# Altium schematic sheet iWoofer_V4_03_OT.SchDoc
size A4; DrawnBy: iWoofer
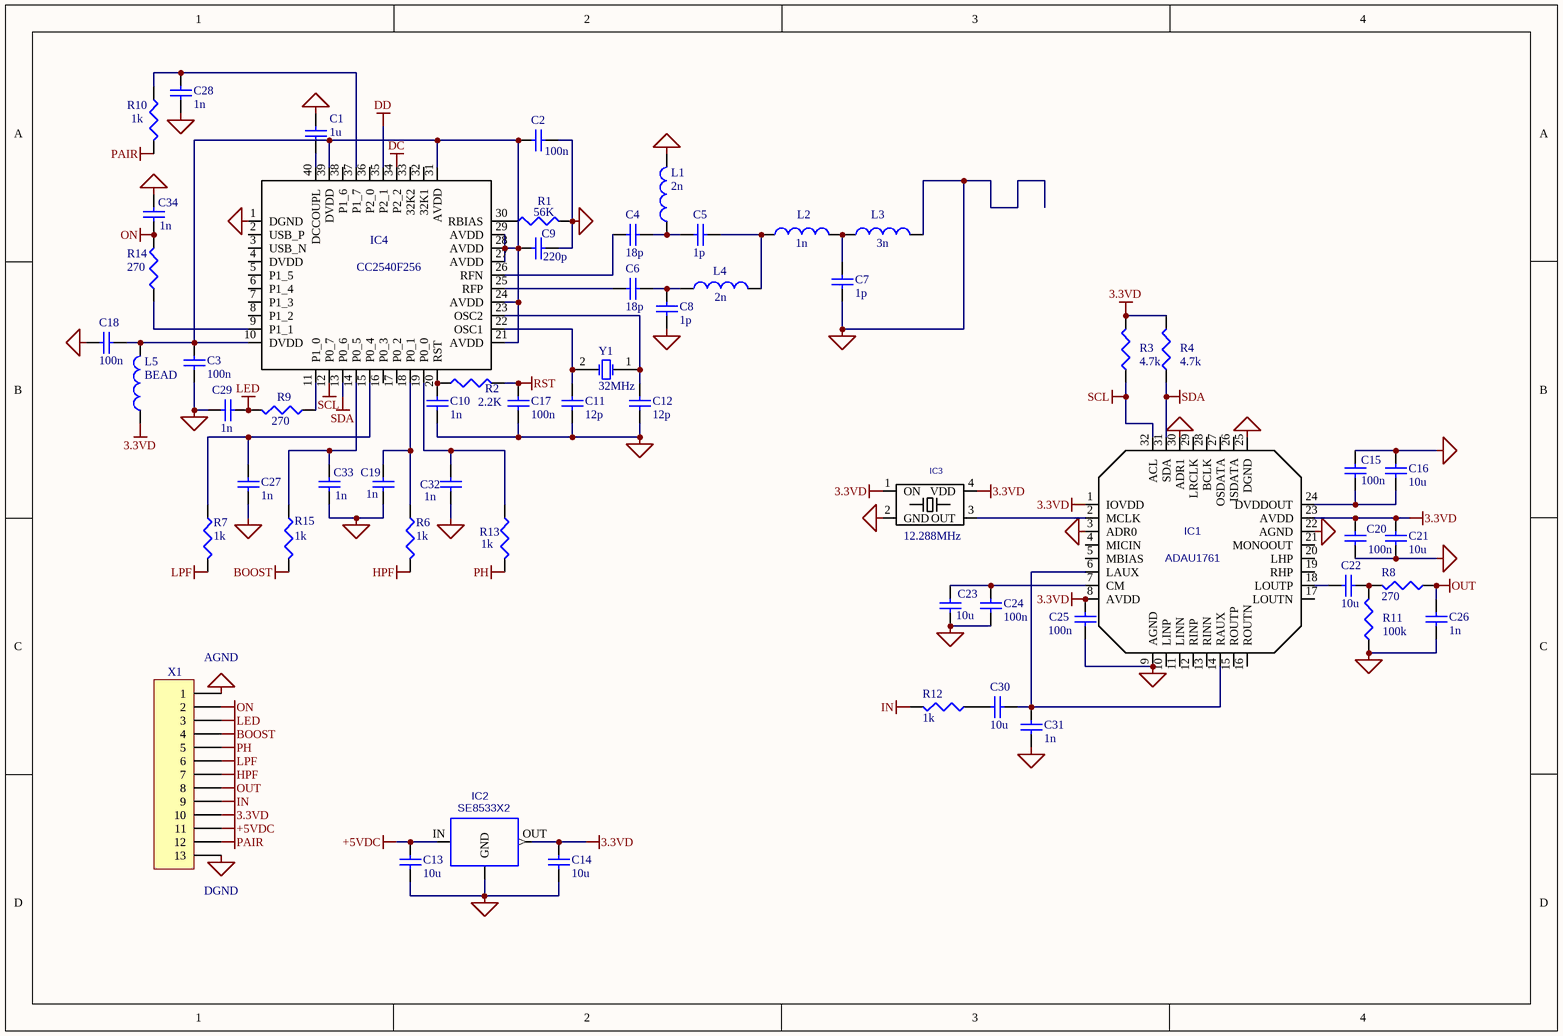
[diagram p0: iWoofer_V4_03_OT.SchDoc]

## Parts
C1  1u  [0402C]
C2  100n  [0402C]
C3  100n  [0402C]
C4  18p  [0402C]
C5  1p  [0402C]
C6  18p  [0402C]
C7  1p  [0402C]
C8  1p  [0402C]
C9  220p  [0402C]
C10  1n  [0402C]
C11  12p  [0402C]
C12  12p  [0402C]
C13  10u  [0805C]
C14  10u  [0805C]
C15  100n  [0402C]
C16  10u  [0805C]
C17  100n  [0402C]
C18  100n  [0402C]
C19  1n  [0402C]
C20  100n  [0402C]
C21  10u  [0805C]
C22  10u  [0805C]
C23  10u  [0805C]
C24  100n  [0402C]
C25  100n  [0603]
C26  1n  [0402C]
C27  1n  [0402C]
C28  1n  [0402C]
C29  1n  [0402C]
C30  10u  [0805C]
C31  1n  [0402C]
C32  1n  [0402C]
C33  1n  [0402C]
C34  1n  [0402C]
IC1  ADAU1761  [ADAU1761_long]
IC2  SE8533X2  [SOT-23_BC807-40(Primary)]
IC3  12.288 MHz  [OSC_3225]  (value not drawn)
IC4  CC2540F256  [cc2540 TOP]
L1  2n  [0402L]
L2  1n  [0402L]
L3  3n  [0402L]
L4  2n  [0402L]
L5  BEAD  [0402L]
R1  56K  [0402R]
R2  2.2K  [0402R]
R3  4.7k  [0402R]
R4  4.7k  [0402R]
R6  1k  [0402R]
R7  1k  [0402R]
R8  270  [0402R]
R9  270  [0402R]
R10  1k  [0402R]
R11  100k  [0402R]
R12  1k  [0402R]
R13  1k  [0402R]
R14  270  [0402R]
R15  1k  [0402R]
X1  Header 13  [HDR1X13]  (value not drawn)
Y1  32MHz  [OSC_3225]

## Nets
3.3VD: C14.2 C20.2 C21.2 C25.2 IC1.1(IOVDD) IC1.8(AVDD) IC1.23(AVDD) IC2.OUT IC3.1(ON) IC3.4(VDD) L5.1 R3.2 R4.2 X1.10
+5VDC: C13.2 IC2.IN X1.11
BOOST: R15.2 X1.4
DC: IC4.34(P2_2)
DD: IC4.35(P2_1)
GND: C1.2 C2.1 C3.1 C7.2 C8.2 C9.2 C10.1 C11.1 C12.1 C13.1 C14.1 C15.2 C16.2 C17.2 C18.1 C19.2 C20.1 C21.1 C23.1 C24.1 C25.1 C26.1 C27.1 C28.1 C29.1 C31.1 C32.1 C33.1 C34.2 IC1.3(ADR0) IC1.9(AGND) IC1.22(AGND) IC1.25(DGND) IC1.30(ADR1) IC2.GND IC3.2(GND) IC4.1(DGND) L1.2 L3.2 R1.2 R11.1 X1.1 X1.13
HPF: R6.2 X1.7
IN: R12.2 X1.9
LED: C29.2 R9.2 X1.3
LPF: R7.2 X1.6
ON: C34.1 R14.2 X1.2
OUT: C26.2 R8.1 X1.8
PAIR: R10.2 X1.12
PH: R13.2 X1.5
RST: C17.1 R2.2
SCL: IC1.32(ACL) IC4.12(P0_7) R3.1
SDA: IC1.31(SDA) IC4.13(P0_6) R4.1
NetC1_1: C1.1 IC4.40(DCCOUPL)
NetC2_2: C2.2 C3.2 C9.1 C18.2 IC4.10(DVDD) IC4.21(AVDD) IC4.24(AVDD) IC4.27(AVDD) IC4.28(AVDD) IC4.29(AVDD) IC4.31(AVDD) IC4.39(DVDD) L5.2
NetC4_1: C4.1 C5.2 L1.1
NetC4_2: C4.2 IC4.26(RFN)
NetC5_1: C5.1 L2.1 L4.2
NetC6_1: C6.1 C8.1 L4.1
NetC6_2: C6.2 IC4.25(RFP)
NetC7_1: C7.1 L2.2 L3.1
NetC10_2: C10.2 IC4.20(RST) R2.1
NetC11_2: C11.2 IC4.22(OSC1) Y1.2(OSC2)
NetC12_2: C12.2 IC4.23(OSC2) Y1.1(OSC1)
NetC15_1: C15.1 C16.1 IC1.24(DVDDOUT)
NetC19_1: C19.1 IC4.18(P0_1) R6.1
NetC22_1: C22.1 IC1.18(LOUTP)
NetC22_2: C22.2 R8.2 R11.2
NetC23_2: C23.2 C24.2 IC1.7(CM)
NetC27_2: C27.2 IC4.15(P0_4) R7.1
NetC28_2: C28.2 IC4.37(P1_7) R10.1
NetC30_1: C30.1 R12.1
NetC30_2: C30.2 C31.2 IC1.6(LAUX) IC1.14(RAUX)
NetC32_2: C32.2 IC4.19(P0_0) R13.1
NetC33_2: C33.2 IC4.14(P0_5) R15.1
NetIC1_2: IC1.2(MCLK) IC3.3(OUT)
NetIC4_9: IC4.9(P1_1) R14.1
NetIC4_11: IC4.11(P1_0) R9.1
NetIC4_30: IC4.30(RBIAS) R1.1

Not connected (* = marked no-connect by the designer): IC1 4(MICIN) 5(MBIAS) 10(LINP) 11(LINN) 12(RINP) 13(RINN) 15(ROUTP) 16(ROUTN) 17(LOUTN) 19(RHP) 20(LHP) 21(MONOOUT) 26(ISDATA) 27(OSDATA) 28(BCLK) 29(LRCLK); IC4 2(USB_P) 3(USB_N) 4(DVDD) 5(P1_5) 6(P1_4) 7(P1_3) 8(P1_2) 16(P0_3) 17(P0_2) 32(32K1) 33(32K2) 36(P2_0) 38(P1_6)

## Notes on the sheet
- (near IC3) 12.288MHz
- (near X1) AGND
- (near X1) DGND

## Library data of the parts
C1-C3 C10 C15 C17-C20 C24-C29 C31-C34 = Cap: Capacitor; Published: 8-Jun-2000; LatestRevisionDate: 17-Jul-2002; LatestRevisionNote: Re-released for DXP Platform.; PackageReference: RAD-0.3; Publisher: Altium Limited
  C1: Value: 1u
  C2 C3 C15 C17 C18 C20 C24 C25: Value: 100n
  C10 C19 C26-C29 C31-C34: Value: 1n
C4-C9 C11 C12 = Cap: Capacitor NPO; Published: 8-Jun-2000; LatestRevisionDate: 17-Jul-2002; LatestRevisionNote: Re-released for DXP Platform.; PackageReference: RAD-0.3; Publisher: Altium Limited
  C4 C6: Value: 18p
  C5 C7 C8: Value: 1p
  C9: Value: 220p
  C11 C12: Value: 12p
C13 C14 C16 C21-C23 C30 = Cap: CL21A476MQMNRN or analog; Published: 8-Jun-2000; LatestRevisionDate: 17-Jul-2002; LatestRevisionNote: Re-released for DXP Platform.; PackageReference: RAD-0.3; Publisher: Altium Limited; Value: 10u
IC1 = ADAU1761: DSP; Value: {Value}
IC2 = 78L05: REGULATOR; pin to pad: GND>2 IN>3 OUT>1; Value: *
IC3 = YSO 321SR: 12.288 MHz Oscillator 5032 case
IC4 = CC2540
L1 L4 = Inductor: HBLS1005-2N0S; Code_IEC: 1005; Published: 8-Jun-2000; LatestRevisionDate: 17-Jul-2002; LatestRevisionNote: Re-released for DXP Platform.; PackageReference: 0402-A; Publisher: Altium Limited; Code_JEITA: 0402; Value: 2n
L2 = Inductor: HBLS1005-1N0S; Code_IEC: 1005; Published: 8-Jun-2000; LatestRevisionDate: 17-Jul-2002; LatestRevisionNote: Re-released for DXP Platform.; PackageReference: 0402-A; Publisher: Altium Limited; Code_JEITA: 0402; Value: 1n
L3 = Inductor: HBLS1005-3N0S; Code_IEC: 1005; Published: 8-Jun-2000; LatestRevisionDate: 17-Jul-2002; LatestRevisionNote: Re-released for DXP Platform.; PackageReference: 0402-A; Publisher: Altium Limited; Code_JEITA: 0402; Value: 3n
L5 = Inductor: bead 200@100MHz; Code_IEC: 1005; Published: 8-Jun-2000; LatestRevisionDate: 17-Jul-2002; LatestRevisionNote: Re-released for DXP Platform.; PackageReference: 0402-A; Publisher: Altium Limited; Code_JEITA: 0402; Value: BEAD
R1-R4 R6-R15 = Res3: Resistor; Published: 8-Jun-2000; LatestRevisionDate: 04-Mar-2005; LatestRevisionNote: PCB Footprint replaced.; PackageReference: J1-0603; Publisher: Altium Limited
  R1: Value: 56K
  R2: Value: 2.2K
  R3 R4: Value: 4.7k
  R6 R7 R10 R12 R13 R15: Value: 1k
  R8 R9 R14: Value: 270
  R11: Value: 100k
X1 = Header 13: Header, 13-Pin; LatestRevisionDate: 17-Jul-2002; LatestRevisionNote: Re-released for DXP Platform.; Publisher: Altium Limited
Y1 = XTAL: Crystal 3225 case 10ppm; pin to pad: 2>3; Published: 8-Jun-2000; LatestRevisionDate: 17-Jul-2002; LatestRevisionNote: Re-released for DXP Platform.; PackageReference: R38; Publisher: Altium Limited